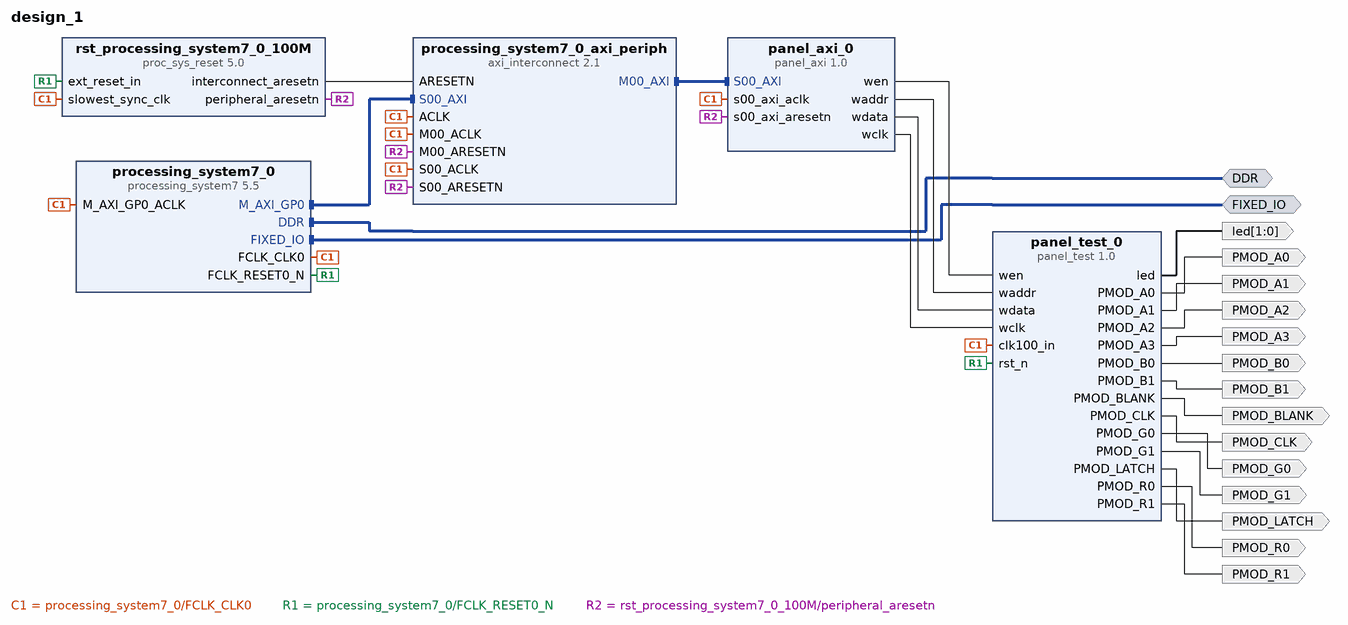
[diagram p0: block diagram of the top level]
# Vivado block design design_1, Vivado 2016.2
create_bd_design design_1

create_bd_intf_port -mode Master -vlnv xilinx.com:interface:ddrx_rtl:1.0 DDR
create_bd_intf_port -mode Master -vlnv xilinx.com:display_processing_system7:fixedio_rtl:1.0 FIXED_IO
create_bd_port -dir O -from 1 -to 0 led
create_bd_port -dir O PMOD_A0
create_bd_port -dir O PMOD_A1
create_bd_port -dir O PMOD_A2
create_bd_port -dir O PMOD_A3
create_bd_port -dir O PMOD_B0
create_bd_port -dir O PMOD_B1
create_bd_port -dir O PMOD_BLANK
create_bd_port -dir O PMOD_CLK
create_bd_port -dir O PMOD_G0
create_bd_port -dir O PMOD_G1
create_bd_port -dir O PMOD_LATCH
create_bd_port -dir O PMOD_R0
create_bd_port -dir O PMOD_R1

create_bd_cell -type ip -vlnv xilinx.com:ip:processing_system7:5.5 processing_system7_0
set_property -dict [list \
  CONFIG.PCW_UIPARAM_DDR_FREQ_MHZ 525 \
  CONFIG.PCW_CRYSTAL_PERIPHERAL_FREQMHZ 50.000000 \
  CONFIG.PCW_APU_PERIPHERAL_FREQMHZ 650 \
  CONFIG.PCW_SDIO_PERIPHERAL_FREQMHZ 50 \
  CONFIG.PCW_FPGA0_PERIPHERAL_FREQMHZ 100 \
  CONFIG.PCW_PRESET_BANK1_VOLTAGE {LVCMOS 1.8V} \
  CONFIG.PCW_UIPARAM_DDR_PARTNO {MT41K128M16 JT-125} \
  CONFIG.PCW_QSPI_PERIPHERAL_ENABLE 1 \
  CONFIG.PCW_QSPI_GRP_SINGLE_SS_ENABLE 1 \
  CONFIG.PCW_QSPI_GRP_FBCLK_ENABLE 1 \
  CONFIG.PCW_ENET0_PERIPHERAL_ENABLE 1 \
  CONFIG.PCW_ENET0_ENET0_IO {MIO 16 .. 27} \
  CONFIG.PCW_ENET0_GRP_MDIO_ENABLE 1 \
  CONFIG.PCW_ENET0_RESET_ENABLE 0 \
  CONFIG.PCW_SD0_PERIPHERAL_ENABLE 1 \
  CONFIG.PCW_SD0_GRP_CD_ENABLE 1 \
  CONFIG.PCW_SD0_GRP_CD_IO {MIO 47} \
  CONFIG.PCW_SD0_GRP_WP_ENABLE 1 \
  CONFIG.PCW_UART1_PERIPHERAL_ENABLE 1 \
  CONFIG.PCW_TTC0_PERIPHERAL_ENABLE 1 \
  CONFIG.PCW_USB0_PERIPHERAL_ENABLE 1 \
  CONFIG.PCW_USB0_RESET_ENABLE 1 \
  CONFIG.PCW_USB0_RESET_IO {MIO 46} \
  CONFIG.PCW_GPIO_MIO_GPIO_ENABLE 1 \
] [get_bd_cells processing_system7_0]
# 105 more settings of processing_system7_0 are not shown: defaults, MIO pin electricals, DDR timing, and values the tool derives
create_bd_cell -type ip -vlnv xilinx.com:ip:axi_interconnect:2.1 processing_system7_0_axi_periph
set_property -dict {CONFIG.NUM_MI 1} [get_bd_cells processing_system7_0_axi_periph]
create_bd_cell -type ip -vlnv xilinx.com:ip:proc_sys_reset:5.0 rst_processing_system7_0_100M
create_bd_cell -type ip -vlnv galois.com:galois:panel_test:1.0 panel_test_0
create_bd_cell -type ip -vlnv user.org:user:panel_axi:1.0 panel_axi_0

# ---- connections ----

connect_bd_intf_net [get_bd_intf_pins processing_system7_0/M_AXI_GP0] [get_bd_intf_pins processing_system7_0_axi_periph/S00_AXI]
connect_bd_intf_net [get_bd_intf_pins processing_system7_0_axi_periph/M00_AXI] [get_bd_intf_pins panel_axi_0/S00_AXI]
connect_bd_intf_net [get_bd_intf_ports DDR] [get_bd_intf_pins processing_system7_0/DDR]
connect_bd_intf_net [get_bd_intf_ports FIXED_IO] [get_bd_intf_pins processing_system7_0/FIXED_IO]
connect_bd_net [get_bd_pins processing_system7_0/FCLK_CLK0] \
  [get_bd_pins processing_system7_0/M_AXI_GP0_ACLK] [get_bd_pins rst_processing_system7_0_100M/slowest_sync_clk] \
  [get_bd_pins panel_test_0/clk100_in] [get_bd_pins processing_system7_0_axi_periph/S00_ACLK] \
  [get_bd_pins processing_system7_0_axi_periph/ACLK] [get_bd_pins processing_system7_0_axi_periph/M00_ACLK] \
  [get_bd_pins panel_axi_0/s00_axi_aclk]
connect_bd_net [get_bd_pins panel_test_0/led] [get_bd_ports led]
connect_bd_net [get_bd_pins processing_system7_0/FCLK_RESET0_N] \
  [get_bd_pins rst_processing_system7_0_100M/ext_reset_in] [get_bd_pins panel_test_0/rst_n]
connect_bd_net [get_bd_pins panel_test_0/PMOD_A0] [get_bd_ports PMOD_A0]
connect_bd_net [get_bd_pins panel_test_0/PMOD_A1] [get_bd_ports PMOD_A1]
connect_bd_net [get_bd_pins panel_test_0/PMOD_A2] [get_bd_ports PMOD_A2]
connect_bd_net [get_bd_pins panel_test_0/PMOD_A3] [get_bd_ports PMOD_A3]
connect_bd_net [get_bd_pins panel_test_0/PMOD_B0] [get_bd_ports PMOD_B0]
connect_bd_net [get_bd_pins panel_test_0/PMOD_B1] [get_bd_ports PMOD_B1]
connect_bd_net [get_bd_pins panel_test_0/PMOD_BLANK] [get_bd_ports PMOD_BLANK]
connect_bd_net [get_bd_pins panel_test_0/PMOD_CLK] [get_bd_ports PMOD_CLK]
connect_bd_net [get_bd_pins panel_test_0/PMOD_G0] [get_bd_ports PMOD_G0]
connect_bd_net [get_bd_pins panel_test_0/PMOD_G1] [get_bd_ports PMOD_G1]
connect_bd_net [get_bd_pins panel_test_0/PMOD_LATCH] [get_bd_ports PMOD_LATCH]
connect_bd_net [get_bd_pins panel_test_0/PMOD_R0] [get_bd_ports PMOD_R0]
connect_bd_net [get_bd_pins panel_test_0/PMOD_R1] [get_bd_ports PMOD_R1]
connect_bd_net [get_bd_pins panel_axi_0/wen] [get_bd_pins panel_test_0/wen]
connect_bd_net [get_bd_pins panel_axi_0/waddr] [get_bd_pins panel_test_0/waddr]
connect_bd_net [get_bd_pins panel_axi_0/wdata] [get_bd_pins panel_test_0/wdata]
connect_bd_net [get_bd_pins panel_axi_0/wclk] [get_bd_pins panel_test_0/wclk]
connect_bd_net [get_bd_pins rst_processing_system7_0_100M/peripheral_aresetn] \
  [get_bd_pins processing_system7_0_axi_periph/S00_ARESETN] [get_bd_pins processing_system7_0_axi_periph/M00_ARESETN] \
  [get_bd_pins panel_axi_0/s00_axi_aresetn]
connect_bd_net [get_bd_pins rst_processing_system7_0_100M/interconnect_aresetn] [get_bd_pins processing_system7_0_axi_periph/ARESETN]

# ---- address map ----
assign_bd_address -offset 0x43C00000 -range 64K -target_address_space [get_bd_addr_spaces processing_system7_0/Data] [get_bd_addr_segs panel_axi_0/S00_AXI/S00_AXI_reg]

validate_bd_design
save_bd_design
